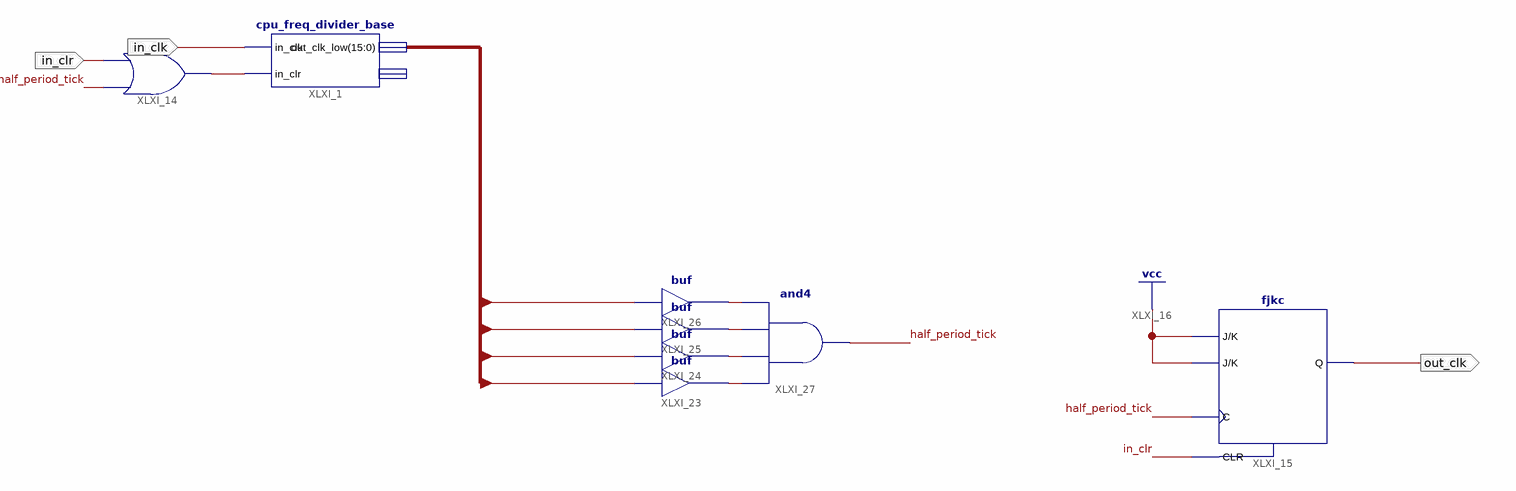
[diagram p0: schematic sheet 1]
// Xilinx ISE schematic cpu_freq_divider_1KHz.sch (aspartan6) as structural Verilog: 8 symbols, 3 ports
module cpu_freq_divider_1KHz (
  input  in_clk,
  input  in_clr,
  output out_clk
);

  wire half_period_tick, XLXN_37, XLXN_44, XLXN_45, XLXN_46, XLXN_47;
  wire [15:0] high;

  cpu_freq_divider_base XLXI_1 (.in_clk(in_clk), .in_clr(XLXN_37), .out_clk_low(high));  // open: out_clk_high
  or XLXI_14 (XLXN_37, half_period_tick, in_clr);
  fjkc XLXI_15 (.C(half_period_tick), .CLR(in_clr), .J(1'b1), .K(1'b1), .Q(out_clk));
  buf XLXI_23 (XLXN_44, high[5]);
  buf XLXI_24 (XLXN_45, high[6]);
  buf XLXI_25 (XLXN_46, high[7]);
  buf XLXI_26 (XLXN_47, high[12]);
  and XLXI_27 (half_period_tick, XLXN_44, XLXN_45, XLXN_46, XLXN_47);
endmodule
